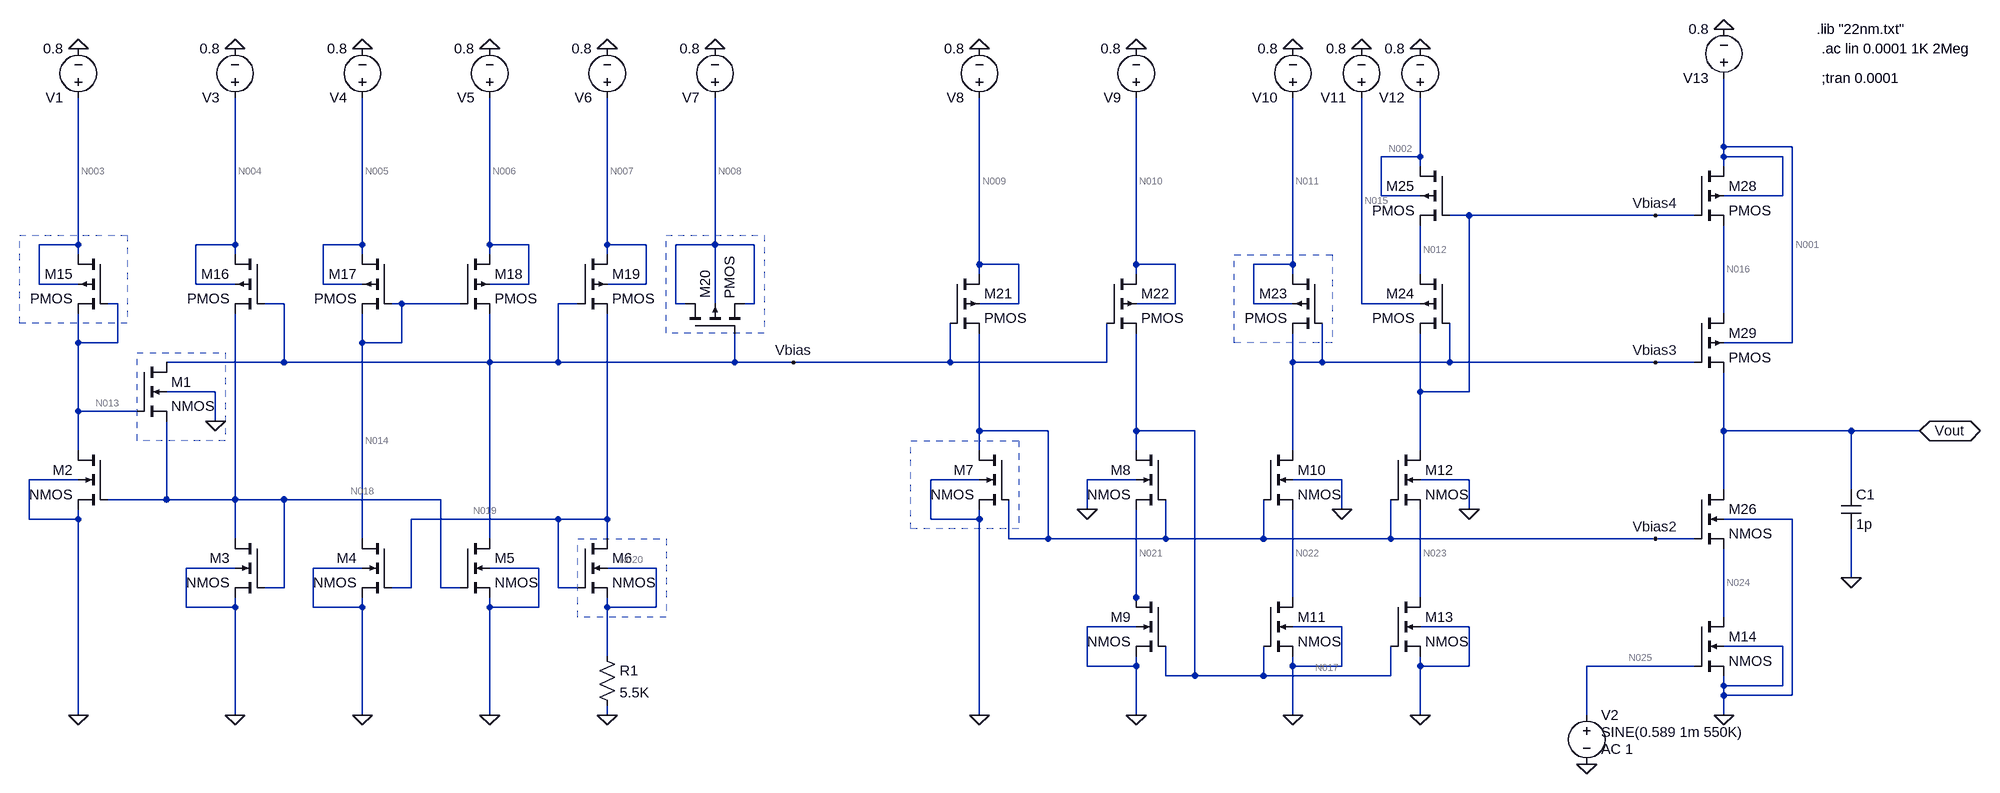
[diagram p0: schematic 22nmSpice.asc]
22nmSpice.asc, the LTspice schematic file:
Version 4
SHEET 1 3488 724
WIRE 2336 -368 2336 -480
WIRE 2448 -368 2336 -368
WIRE 1840 -352 1840 -448
WIRE 1840 -352 1776 -352
WIRE 2336 -352 2336 -368
WIRE 2432 -352 2336 -352
WIRE 1840 -336 1840 -352
WIRE 2336 -336 2336 -352
WIRE 1776 -288 1776 -352
WIRE 1840 -288 1776 -288
WIRE 2432 -288 2432 -352
WIRE 2432 -288 2336 -288
WIRE 1920 -256 1888 -256
WIRE 2224 -256 1920 -256
WIRE 2288 -256 2224 -256
WIRE -352 -208 -352 -448
WIRE -352 -208 -416 -208
WIRE -96 -208 -96 -448
WIRE -96 -208 -160 -208
WIRE 112 -208 112 -448
WIRE 112 -208 48 -208
WIRE 320 -208 320 -448
WIRE 384 -208 320 -208
WIRE 512 -208 512 -448
WIRE 576 -208 512 -208
WIRE 688 -208 688 -448
WIRE 688 -208 624 -208
WIRE 752 -208 688 -208
WIRE -352 -192 -352 -208
WIRE -96 -192 -96 -208
WIRE 112 -192 112 -208
WIRE 320 -192 320 -208
WIRE 512 -192 512 -208
WIRE 1120 -176 1120 -448
WIRE 1184 -176 1120 -176
WIRE 1376 -176 1376 -448
WIRE 1440 -176 1376 -176
WIRE 1632 -176 1632 -448
WIRE 1632 -176 1568 -176
WIRE 1120 -160 1120 -176
WIRE 1376 -160 1376 -176
WIRE 1632 -160 1632 -176
WIRE 1840 -160 1840 -240
WIRE -416 -144 -416 -208
WIRE -352 -144 -416 -144
WIRE -160 -144 -160 -208
WIRE -96 -144 -160 -144
WIRE 48 -144 48 -208
WIRE 112 -144 48 -144
WIRE 384 -144 384 -208
WIRE 384 -144 320 -144
WIRE 576 -144 576 -208
WIRE 576 -144 512 -144
WIRE -288 -112 -304 -112
WIRE -16 -112 -48 -112
WIRE 176 -112 160 -112
WIRE 272 -112 176 -112
WIRE 464 -112 432 -112
WIRE 624 -112 624 -208
WIRE 640 -112 624 -112
WIRE 688 -112 688 -208
WIRE 752 -112 752 -208
WIRE 752 -112 736 -112
WIRE 1184 -112 1184 -176
WIRE 1184 -112 1120 -112
WIRE 1440 -112 1440 -176
WIRE 1440 -112 1376 -112
WIRE 1568 -112 1568 -176
WIRE 1632 -112 1568 -112
WIRE 1744 -112 1744 -448
WIRE 1840 -112 1744 -112
WIRE 2336 -96 2336 -240
WIRE -352 -48 -352 -96
WIRE -288 -48 -288 -112
WIRE -288 -48 -352 -48
WIRE 112 -48 112 -96
WIRE 176 -48 176 -112
WIRE 176 -48 112 -48
WIRE 2448 -48 2448 -368
WIRE 2448 -48 2336 -48
WIRE -16 -16 -16 -112
WIRE -16 -16 -208 -16
WIRE 320 -16 320 -96
WIRE 320 -16 -16 -16
WIRE 432 -16 432 -112
WIRE 432 -16 320 -16
WIRE 720 -16 720 -64
WIRE 720 -16 432 -16
WIRE 816 -16 720 -16
WIRE 1072 -16 1072 -80
WIRE 1072 -16 816 -16
WIRE 1328 -16 1328 -80
WIRE 1328 -16 1072 -16
WIRE 1632 -16 1632 -64
WIRE 1680 -16 1680 -80
WIRE 1680 -16 1632 -16
WIRE 1888 -16 1888 -80
WIRE 1888 -16 1680 -16
WIRE 2224 -16 1888 -16
WIRE 2288 -16 2224 -16
WIRE -128 32 -208 32
WIRE 1840 32 1840 -64
WIRE 1920 32 1920 -256
WIRE 1920 32 1840 32
WIRE -352 64 -352 -48
WIRE -256 64 -352 64
WIRE -128 80 -128 32
WIRE 1120 96 1120 -64
WIRE 1232 96 1120 96
WIRE 1376 96 1376 -64
WIRE 1472 96 1376 96
WIRE 2336 96 2336 0
WIRE 2544 96 2336 96
WIRE 2656 96 2544 96
WIRE -352 128 -352 64
WIRE 1120 128 1120 96
WIRE 1376 128 1376 96
WIRE 1632 128 1632 -16
WIRE 1840 128 1840 32
WIRE -352 176 -432 176
WIRE 1120 176 1040 176
WIRE 1376 176 1296 176
WIRE 1712 176 1632 176
WIRE 1920 176 1840 176
WIRE 2336 192 2336 96
WIRE 2544 192 2544 96
WIRE -208 208 -208 80
WIRE -208 208 -304 208
WIRE -96 208 -96 -96
WIRE -96 208 -208 208
WIRE -16 208 -96 208
WIRE 240 208 -16 208
WIRE 1296 224 1296 176
WIRE 1712 224 1712 176
WIRE 1920 224 1920 176
WIRE -432 240 -432 176
WIRE -352 240 -352 224
WIRE -352 240 -432 240
WIRE 432 240 192 240
WIRE 512 240 512 -96
WIRE 512 240 432 240
WIRE 1040 240 1040 176
WIRE 1120 240 1120 224
WIRE 1120 240 1040 240
WIRE 2448 240 2336 240
WIRE -96 272 -96 208
WIRE 112 272 112 -48
WIRE 320 272 320 -16
WIRE 512 272 512 240
WIRE 1168 272 1168 208
WIRE 1232 272 1232 96
WIRE 1232 272 1168 272
WIRE 1424 272 1424 208
WIRE 1424 272 1232 272
WIRE 1584 272 1584 208
WIRE 1584 272 1424 272
WIRE 1792 272 1792 208
WIRE 1792 272 1584 272
WIRE 2224 272 1792 272
WIRE 2288 272 2224 272
WIRE -96 320 -176 320
WIRE 112 320 32 320
WIRE 400 320 320 320
WIRE 592 320 512 320
WIRE 2544 336 2544 256
WIRE -16 352 -16 208
WIRE -16 352 -48 352
WIRE 192 352 192 240
WIRE 192 352 160 352
WIRE 240 352 240 208
WIRE 272 352 240 352
WIRE 432 352 432 240
WIRE 464 352 432 352
WIRE 1376 368 1376 224
WIRE 1632 368 1632 224
WIRE 1840 368 1840 224
WIRE -176 384 -176 320
WIRE -96 384 -96 368
WIRE -96 384 -176 384
WIRE 32 384 32 320
WIRE 112 384 112 368
WIRE 112 384 32 384
WIRE 320 384 320 368
WIRE 400 384 400 320
WIRE 400 384 320 384
WIRE 512 384 512 368
WIRE 592 384 592 320
WIRE 592 384 512 384
WIRE 1376 384 1376 368
WIRE 2336 400 2336 288
WIRE 1376 416 1296 416
WIRE 1712 416 1632 416
WIRE 1920 416 1840 416
WIRE 2432 448 2336 448
WIRE 512 464 512 384
WIRE 1296 480 1296 416
WIRE 1376 480 1376 464
WIRE 1376 480 1296 480
WIRE 1632 480 1632 464
WIRE 1712 480 1712 416
WIRE 1712 480 1632 480
WIRE 1840 480 1840 464
WIRE 1920 480 1920 416
WIRE 1920 480 1840 480
WIRE 2288 480 2112 480
WIRE 1424 496 1424 448
WIRE 1472 496 1472 96
WIRE 1472 496 1424 496
WIRE 1584 496 1584 448
WIRE 1584 496 1472 496
WIRE 1792 496 1792 448
WIRE 1792 496 1584 496
WIRE 2336 512 2336 496
WIRE 2432 512 2432 448
WIRE 2432 512 2336 512
WIRE 2336 528 2336 512
WIRE 2448 528 2448 240
WIRE 2448 528 2336 528
WIRE -352 560 -352 240
WIRE -96 560 -96 384
WIRE 112 560 112 384
WIRE 320 560 320 384
WIRE 512 560 512 544
WIRE 1120 560 1120 240
WIRE 1376 560 1376 480
WIRE 1632 560 1632 480
WIRE 1840 560 1840 480
WIRE 2112 560 2112 480
WIRE 2336 560 2336 528
FLAG -352 -528 0
FLAG -352 560 0
FLAG -96 560 0
FLAG 112 560 0
FLAG 320 560 0
FLAG 512 560 0
FLAG 1120 560 0
FLAG 1376 560 0
FLAG 1632 560 0
FLAG 1840 560 0
FLAG 1920 224 0
FLAG 1712 224 0
FLAG 1296 224 0
FLAG -128 80 0
FLAG 2224 -256 Vbias4
FLAG 2224 -16 Vbias3
FLAG 2224 272 Vbias2
FLAG 2336 560 0
FLAG 2112 640 0
FLAG 2656 96 Vout
IOPIN 2656 96 BiDir
FLAG 2544 336 0
FLAG 816 -16 Vbias
FLAG -96 -528 0
FLAG 112 -528 0
FLAG 320 -528 0
FLAG 512 -528 0
FLAG 688 -528 0
FLAG 1120 -528 0
FLAG 1376 -528 0
FLAG 1632 -528 0
FLAG 1744 -528 0
FLAG 1840 -528 0
FLAG 2336 -560 0
DATAFLAG 2080 -256 ""
DATAFLAG 2080 -16 ""
DATAFLAG 2080 272 ""
DATAFLAG 944 -16 ""
DATAFLAG 2576 96 ""
DATAFLAG 2112 480 ""
SYMBOL nmos4 -256 -16 R0
SYMATTR InstName M1
SYMATTR Value2 l=22n w=88n
SYMBOL nmos4 -304 128 M0
SYMATTR InstName M2
SYMATTR Value2 l=44n w=220n
SYMBOL nmos4 -48 272 M0
SYMATTR InstName M3
SYMATTR Value2 l=44n w=220n
SYMBOL nmos4 160 272 M0
SYMATTR InstName M4
SYMATTR Value2 l=44n w=220n
SYMBOL nmos4 272 272 R0
SYMATTR InstName M5
SYMATTR Value2 l=44n w=220n
SYMBOL nmos4 464 272 R0
SYMATTR InstName M6
SYMATTR Value2 l=44n w=660n
SYMBOL nmos4 1168 128 M0
SYMATTR InstName M7
SYMATTR Value2 l=44n w=103n
SYMBOL nmos4 1424 128 M0
SYMATTR InstName M8
SYMATTR Value2 l=44n w=220n
SYMBOL nmos4 1424 368 M0
SYMATTR InstName M9
SYMATTR Value2 l=44n w=220n
SYMBOL nmos4 1584 128 R0
SYMATTR InstName M10
SYMATTR Value2 l=44n w=220n
SYMBOL nmos4 1584 368 R0
SYMATTR InstName M11
SYMATTR Value2 l=44n w=66n
SYMBOL nmos4 1792 128 R0
SYMATTR InstName M12
SYMATTR Value2 l=44n w=220n
SYMBOL nmos4 1792 368 R0
SYMATTR InstName M13
SYMATTR Value2 l=44n w=220n
SYMBOL pmos4 -304 -192 M0
SYMATTR InstName M15
SYMATTR Value2 l=440n w=220n
SYMBOL pmos4 -48 -192 M0
SYMATTR InstName M16
SYMATTR Value2 l=44n w=528n
SYMBOL pmos4 160 -192 M0
SYMATTR InstName M17
SYMATTR Value2 l=44n w=528n
SYMBOL pmos4 272 -192 R0
SYMATTR InstName M18
SYMATTR Value2 l=44n w=528n
SYMBOL pmos4 464 -192 R0
SYMATTR InstName M19
SYMATTR Value2 l=44n w=528n
SYMBOL pmos4 640 -64 R270
SYMATTR InstName M20
SYMATTR Value2 l=1100n w=1100n
SYMBOL pmos4 1072 -160 R0
SYMATTR InstName M21
SYMATTR Value2 l=44n w=528n
SYMBOL pmos4 1328 -160 R0
SYMATTR InstName M22
SYMATTR Value2 l=44n w=528n
SYMBOL pmos4 1680 -160 M0
SYMATTR InstName M23
SYMATTR Value2 l=110n w=440n
SYMBOL pmos4 1888 -160 M0
SYMATTR InstName M24
SYMATTR Value2 l=44n w=528n
SYMBOL pmos4 1888 -336 M0
SYMATTR InstName M25
SYMATTR Value2 l=44n w=400n
SYMBOL voltage -352 -432 R180
WINDOW 123 0 0 Left 0
WINDOW 39 0 0 Left 0
SYMATTR InstName V1
SYMATTR Value 0.8
SYMBOL res 496 448 R0
SYMATTR InstName R1
SYMATTR Value 5.5K
SYMBOL voltage 2112 544 R0
WINDOW 123 24 72 Left 2
WINDOW 39 0 0 Left 0
WINDOW 3 24 44 Left 2
SYMATTR Value2 AC 1
SYMATTR Value SINE(0.589 1m 550K)
SYMATTR InstName V2
SYMBOL nmos4 2288 400 R0
SYMATTR InstName M14
SYMATTR Value2 l=66n w=356n
SYMBOL nmos4 2288 192 R0
SYMATTR InstName M26
SYMATTR Value2 l=44n w=358n
SYMBOL pmos4 2288 -336 R0
SYMATTR InstName M28
SYMATTR Value2 l=66n w=1125n
SYMBOL pmos4 2288 -96 R0
SYMATTR InstName M29
SYMATTR Value2 l=66n w=1127n
SYMBOL cap 2528 192 R0
SYMATTR InstName C1
SYMATTR Value 1p
SYMBOL voltage -96 -432 R180
WINDOW 123 0 0 Left 0
WINDOW 39 0 0 Left 0
SYMATTR InstName V3
SYMATTR Value 0.8
SYMBOL voltage 112 -432 R180
WINDOW 123 0 0 Left 0
WINDOW 39 0 0 Left 0
SYMATTR InstName V4
SYMATTR Value 0.8
SYMBOL voltage 320 -432 R180
WINDOW 123 0 0 Left 0
WINDOW 39 0 0 Left 0
SYMATTR InstName V5
SYMATTR Value 0.8
SYMBOL voltage 512 -432 R180
WINDOW 123 0 0 Left 0
WINDOW 39 0 0 Left 0
SYMATTR InstName V6
SYMATTR Value 0.8
SYMBOL voltage 688 -432 R180
WINDOW 123 0 0 Left 0
WINDOW 39 0 0 Left 0
SYMATTR InstName V7
SYMATTR Value 0.8
SYMBOL voltage 1120 -432 R180
WINDOW 123 0 0 Left 0
WINDOW 39 0 0 Left 0
SYMATTR InstName V8
SYMATTR Value 0.8
SYMBOL voltage 1376 -432 R180
WINDOW 123 0 0 Left 0
WINDOW 39 0 0 Left 0
SYMATTR InstName V9
SYMATTR Value 0.8
SYMBOL voltage 1632 -432 R180
WINDOW 123 0 0 Left 0
WINDOW 39 0 0 Left 0
SYMATTR InstName V10
SYMATTR Value 0.8
SYMBOL voltage 1744 -432 R180
WINDOW 123 0 0 Left 0
WINDOW 39 0 0 Left 0
SYMATTR InstName V11
SYMATTR Value 0.8
SYMBOL voltage 1840 -432 R180
WINDOW 123 0 0 Left 0
WINDOW 39 0 0 Left 0
SYMATTR InstName V12
SYMATTR Value 0.8
SYMBOL voltage 2336 -464 R180
WINDOW 123 0 0 Left 0
WINDOW 39 0 0 Left 0
SYMATTR InstName V13
SYMATTR Value 0.8
TEXT 2488 -560 Left 2 !.lib "22nm.txt"
TEXT 2496 -528 Left 2 !.ac lin 0.0001 1K 2Meg
TEXT 2496 -480 Left 2 !;tran 0.0001
RECTANGLE Normal -272 -80 -448 -224 2
RECTANGLE Normal -112 112 -256 -32 2
RECTANGLE Normal 608 400 464 272 2
RECTANGLE Normal 768 -64 608 -224 2
RECTANGLE Normal 1184 256 1008 112 2
RECTANGLE Normal 1696 -48 1536 -192 2

The netlist it stands for:
* 22nmSpice.asc
M1 Vbias N013 N018 0 NMOS l=22n w=88n
M2 N013 N018 0 0 NMOS l=44n w=220n
M3 N018 N018 0 0 NMOS l=44n w=220n
M4 N014 N019 0 0 NMOS l=44n w=220n
M5 Vbias N018 0 0 NMOS l=44n w=220n
M6 N019 N019 N020 N020 NMOS l=44n w=660n
M7 Vbias2 Vbias2 0 0 NMOS l=44n w=103n
M8 N017 Vbias2 N021 0 NMOS l=44n w=220n
M9 N021 N017 0 0 NMOS l=44n w=220n
M10 Vbias3 Vbias2 N022 0 NMOS l=44n w=220n
M11 N022 N017 0 0 NMOS l=44n w=66n
M12 Vbias4 Vbias2 N023 0 NMOS l=44n w=220n
M13 N023 N017 0 0 NMOS l=44n w=220n
M15 N003 N013 N013 N003 PMOS l=440n w=220n
M16 N004 Vbias N018 N004 PMOS l=44n w=528n
M17 N005 N014 N014 N005 PMOS l=44n w=528n
M18 N006 N014 Vbias N006 PMOS l=44n w=528n
M19 N007 Vbias N019 N007 PMOS l=44n w=528n
M20 N008 Vbias N008 N008 PMOS l=1100n w=1100n
M21 N009 Vbias Vbias2 N009 PMOS l=44n w=528n
M22 N010 Vbias N017 N010 PMOS l=44n w=528n
M23 N011 Vbias3 Vbias3 N011 PMOS l=110n w=440n
M24 N012 Vbias3 Vbias4 N015 PMOS l=44n w=528n
M25 N002 Vbias4 N012 N002 PMOS l=44n w=400n
V1 N003 0 0.8
R1 N020 0 5.5K
V2 N025 0 SINE(0.589 1m 550K) AC 1
M14 N024 N025 0 0 NMOS l=66n w=356n
M26 Vout Vbias2 N024 0 NMOS l=44n w=358n
M28 N001 Vbias4 N016 N001 PMOS l=66n w=1125n
M29 N016 Vbias3 Vout N001 PMOS l=66n w=1127n
C1 Vout 0 1p
V3 N004 0 0.8
V4 N005 0 0.8
V5 N006 0 0.8
V6 N007 0 0.8
V7 N008 0 0.8
V8 N009 0 0.8
V9 N010 0 0.8
V10 N011 0 0.8
V11 N015 0 0.8
V12 N002 0 0.8
V13 N001 0 0.8
.model NMOS NMOS
.model PMOS PMOS
.lib standard.mos
.lib "22nm.txt"
.ac lin 0.0001 1K 2Meg
;tran 0.0001
.backanno
.end

* Results of the author's LTspice run, read from the files saved beside the schematic
* Operating Point, zero values left out:
*   V(vbias) = 228.8 mV
*   V(n013) = 12.37 mV
*   V(n018) = 556.7 mV
*   V(n014) = 249.2 mV
*   V(n019) = 555.4 mV
*   V(n020) = 67.49 mV
*   V(vbias2) = 619.1 mV
*   V(n017) = 612.9 mV
*   V(n021) = 53.52 mV
*   V(vbias3) = 197.2 mV
*   V(n022) = 91.58 mV
*   V(vbias4) = 115.8 mV
*   V(n023) = 41.76 mV
*   V(n003) = 800 mV
*   V(n004) = 800 mV
*   V(n005) = 800 mV
*   V(n006) = 800 mV
*   V(n007) = 800 mV
*   V(n008) = 800 mV
*   V(n009) = 800 mV
*   V(n010) = 800 mV
*   V(n011) = 800 mV
*   V(n012) = 747.7 mV
*   V(n015) = 800 mV
*   V(n002) = 800 mV
*   V(n025) = 589 mV
*   V(n024) = 75.13 mV
*   V(vout) = 463.1 mV
*   V(n001) = 800 mV
*   V(n016) = 762.3 mV
*   Ig(M1) = -7.008 pA
*   Is(M1) = 7.186 pA
*   Id(M2) = 2.067 µA
*   Ig(M2) = 23.14 pA
*   Is(M2) = -2.067 µA
*   Id(M3) = 12.26 µA
*   Ig(M3) = 17.84 pA
*   Is(M3) = -12.26 µA
*   Id(M4) = 10.8 µA
*   Ig(M4) = 18.11 pA
*   Is(M4) = -10.8 µA
*   Id(M5) = 10.9 µA
*   Ig(M5) = 18.62 pA
*   Is(M5) = -10.9 µA
*   Id(M6) = 12.27 µA
*   Ig(M6) = 16.73 pA
*   Is(M6) = -12.27 µA
*   Id(M7) = 11.7 µA
*   Ig(M7) = 17.33 pA
*   Is(M7) = -11.7 µA
*   Id(M8) = 11.78 µA
*   Ig(M8) = 20.49 pA
*   Is(M8) = -11.78 µA
*   Id(M9) = 11.78 µA
*   Ig(M9) = 42.77 pA
*   Is(M9) = -11.78 µA
*   Id(M10) = 4.577 µA
*   Ig(M10) = 13.21 pA
*   Is(M10) = -4.577 µA
*   Id(M11) = 4.577 µA
*   Ig(M11) = 10.98 pA
*   Is(M11) = -4.577 µA
*   Id(M12) = 9.655 µA
*   Ig(M12) = 27.94 pA
*   Is(M12) = -9.655 µA
*   Id(M13) = 9.655 µA
*   Ig(M13) = 43.33 pA
*   Is(M13) = -9.655 µA
*   Id(M14) = 12.37 µA
*   Ig(M14) = 78.03 pA
*   Is(M14) = -12.37 µA
*   Id(M26) = 12.37 µA
*   Ig(M26) = 24.47 pA
*   Is(M26) = -12.37 µA
*   Id(M15) = 2.067 µA
*   Ig(M15) = -60.7 pA
*   Ib(M15) = 61.41 pA
*   Is(M15) = -2.067 µA
*   Id(M16) = 12.26 µA
*   Is(M16) = -12.26 µA
*   Id(M17) = 10.8 µA
*   Is(M17) = -10.8 µA
*   Id(M18) = 10.9 µA
*   Is(M18) = -10.9 µA
*   Id(M19) = 12.27 µA
*   Is(M19) = -12.27 µA
*   Ig(M20) = -15.05 pA
*   Ib(M20) = 14.9 pA
*   Id(M21) = 11.7 µA
*   Is(M21) = -11.7 µA
*   Id(M22) = 11.78 µA
*   Is(M22) = -11.78 µA
*   Id(M23) = 4.577 µA
*   Ib(M23) = 1.538 pA
*   Is(M23) = -4.577 µA
*   Id(M24) = 9.655 µA
*   Is(M24) = -9.655 µA
*   Id(M25) = 9.655 µA
*   Ig(M25) = -1.216 pA
*   Ib(M25) = 1.262 pA
*   Is(M25) = -9.655 µA
*   Id(M28) = 12.37 µA
*   Ig(M28) = -5.869 pA
*   Ib(M28) = 5.879 pA
*   Is(M28) = -12.37 µA
*   Id(M29) = 12.37 µA
*   Ib(M29) = 1.137 pA
*   Is(M29) = -12.37 µA
*   I(R1) = 12.27 µA
*   I(V1) = -2.067 µA
*   I(V2) = -78.03 pA
*   I(V3) = -12.26 µA
*   I(V4) = -10.8 µA
*   I(V5) = -10.9 µA
*   I(V6) = -12.27 µA
*   I(V7) = -15.05 pA
*   I(V8) = -11.7 µA
*   I(V9) = -11.78 µA
*   I(V10) = -4.577 µA
*   I(V12) = -9.655 µA
*   I(V13) = -12.37 µA
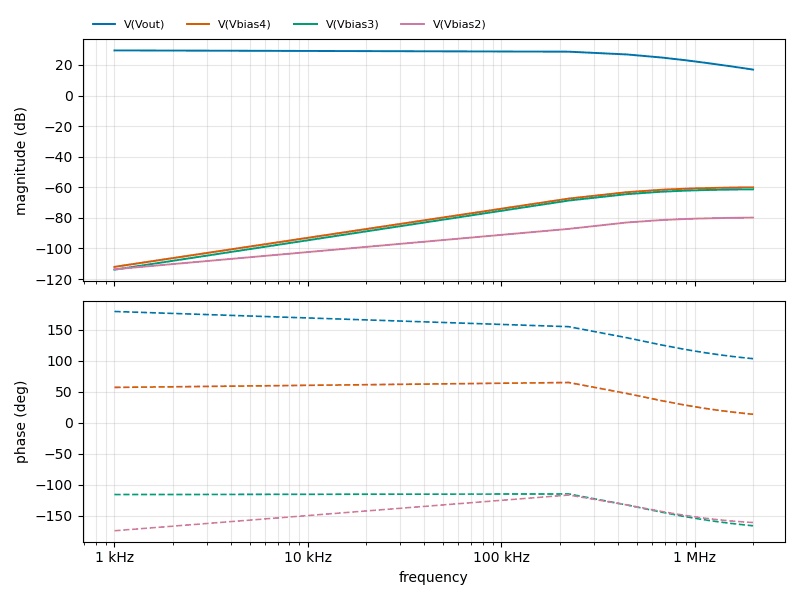
[diagram p1: AC Analysis of 22nmSpice.asc, plotted from the saved traces]
* AC Analysis, 1 run:
*   V(Vout): 29.54 dB at 1 kHz, 16.99 dB at 2 MHz, peak 29.54 dB at 1 kHz, 3 dB below the peak at 479.7 kHz
*   V(Vbias4): -112.05 dB at 1 kHz, -60.06 dB at 2 MHz, peak -60.06 dB at 2 MHz, 3 dB below the peak at 462.3 kHz
*   V(Vbias3): -113.89 dB at 1 kHz, -61.31 dB at 2 MHz, peak -61.31 dB at 2 MHz, 3 dB below the peak at 462.3 kHz
*   V(Vbias2): -113.62 dB at 1 kHz, -79.82 dB at 2 MHz, peak -79.82 dB at 2 MHz, 3 dB below the peak at 467.2 kHz